# EAGLE design 1channelSimple (EAGLE 7.1.0)
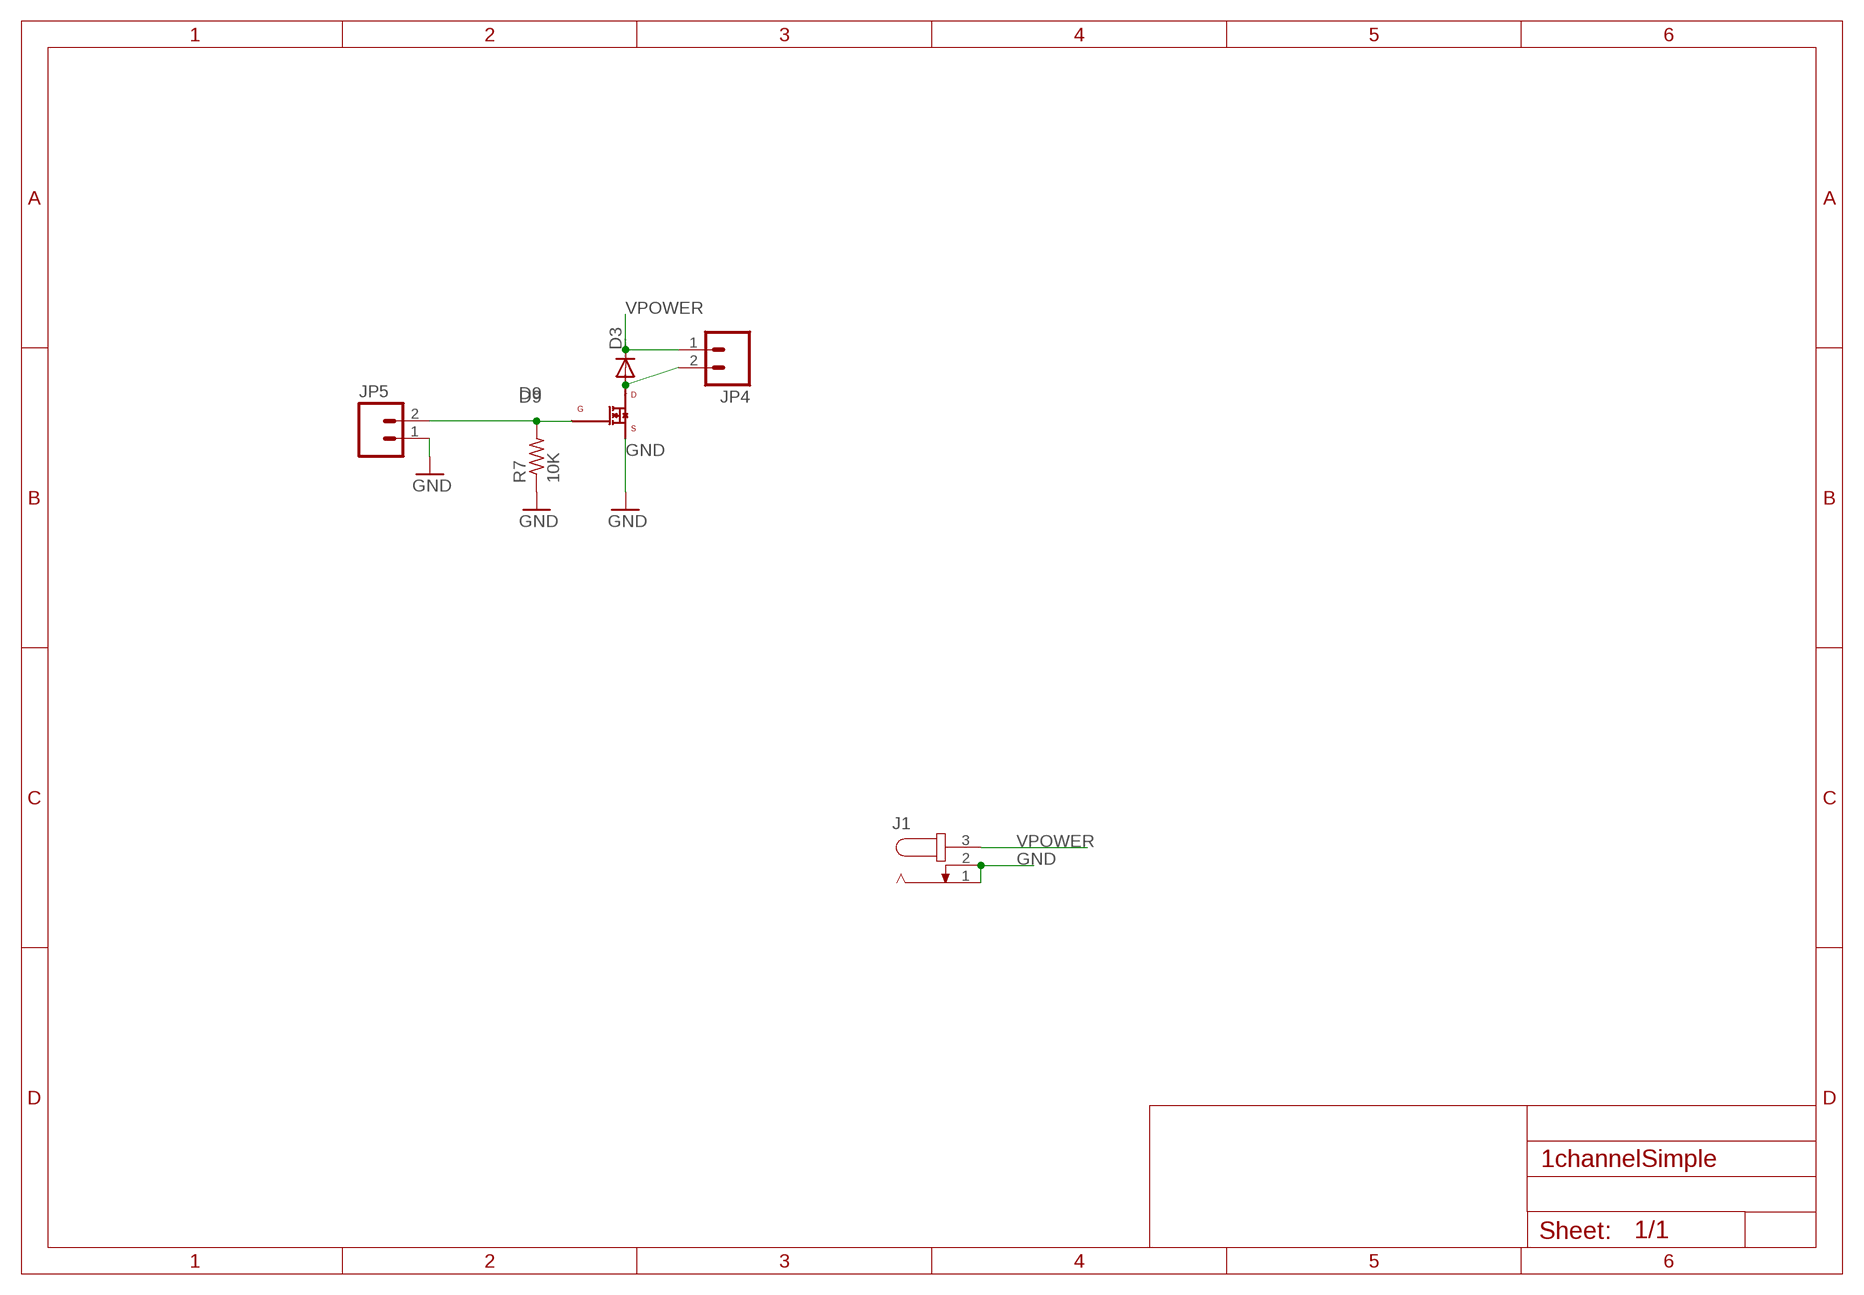
[diagram p0: schematic, sheet 1]

## Parts
D3  DIODE-DO-214AC  [DO-214AC]
J1  JACK-PLUG1  [SPC4078]
JP4  M02PTH  [1X02]
JP5  M02PTH  [1X02]
Q3  IRLML0060  [SOT-23]
R7  10K  R-US_R0603  [R0603]

## Nets
D9: JP5.2 Q3.1(GATE) R7.2
GND: J1.1 J1.2 JP5.1 Q3.2(SOURCE) R7.1
N$2: D3.A JP4.2 Q3.3(DRAIN)
VPOWER: D3.C J1.3 JP4.1

## Library data of the parts
D3 = diode:DIODE-: DIODE
J1 = con-jack:JACK-PLUG: DC POWER JACK Power Jack, DC, Right Angle, Through Hole, Rated 5A at 16VDC, PC Terminals Distributor: Farnell (www.Farnell.de) Drawing: 84N1161.pdf / 84N1162.pdf Manufacturer: SPC Technology (www.spctechnology.com) Type: SPC4077 / SPC 4078; OC_FARNELL: unknown; OC_NEWARK: unknown
JP4 JP5 = SparkFun-Connectors:M02: Standard 2-pin 0.1" header. Use with - straight break away headers ( PRT-00116) - right angle break away headers (PRT-00553) - swiss pins (PRT-00743) - machine pins (PRT-00117) - female headers (PRT-00115) Molex polarized connector foot print use with: PRT-08233 with associated crimp pins and housings. 2.54_SCREWTERM for use with PRT-10571. 3.5mm Screw Terminal footprints for PRT-08084 5mm Screw Terminal footprints for use with PRT-08432
Q3 = spietz-library:IRLML0060
R7 = resistor:R-US_: RESISTOR, American symbol

## Net classes
0 default: width 0.203 mm
1 vcc: width 0.254 mm

## Board
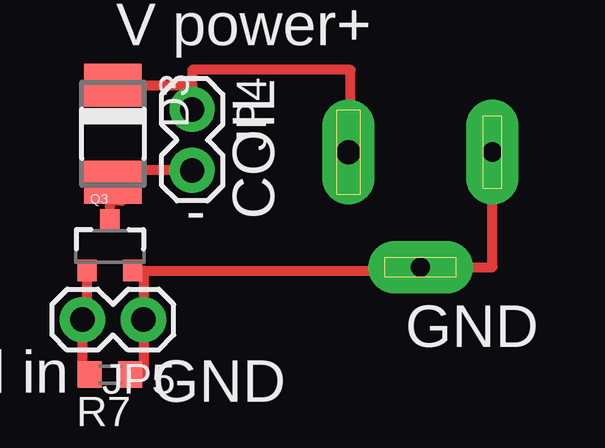
[diagram p1: board, top side]
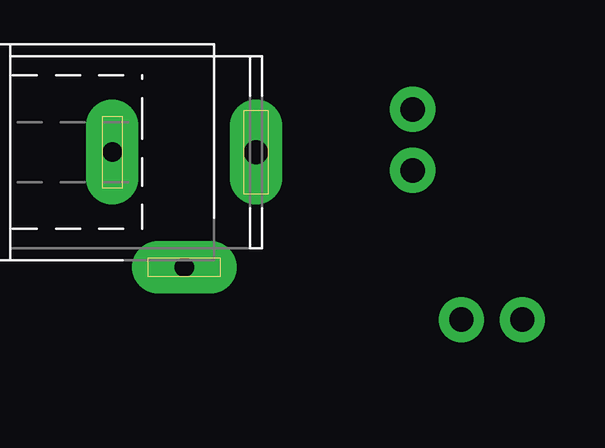
[diagram p2: board, bottom side, seen from below]

No outline drawn. Coordinates in mm, seen from the top.
Copper layers (1*16): Top 0.035mm / dielectric 1.5mm / Bottom 0.035mm
Design rules "default": minimum track width 10mil, minimum drill 24mil, track to track 8mil, track to pad 8mil, pad to pad 8mil, via to via 8mil, smd to smd 8mil, copper to edge 40mil, drill to drill 8mil, minimum pad ring 10mil, minimum via ring 8mil, stop-mask expansion 4mil, vias tented up to drill 0mil, thermal gap 10mil

### Footprints (pad centres in the part's own frame; a part is rotated, then mirrored left to right if it is on the bottom)
DO-214AC = smd 1.8 x 2.4: A 2.025,0; C -2.025,0
SPC4078 = drill 0.8 pad 2.184 long: 1 -3,0; 2 0,-4.8 | drill 1 pad 2.184 long: 3 3,0
1X02 = drill 1.016 pad 1.88: 1 0,0; 2 2.54,0
SOT-23 = smd 0.8 x 0.9: 1 -0.95,-1; 2 0.95,-1; 3 0,1.1
R0603 = smd 1 x 1.1: 1 -0.85,0; 2 0.85,0

### Placement (x,y rotation side)
D3  24.13,24.26 270 top
J1  36.96,23.5 0 bottom
JP4  27.43,25.27 270 top
JP5  25.4,16.51 180 top
Q3  24,19.56 0 top
R7  24,14.22 180 top

### Tracks (layer width: path | path; a pad name or v marks a point on that pad's centre or on a via)
D9
  Top 0.406: R7.2 22.86,14.22 JP5.2 23.05,16.51 Q3.1
GND
  Top 0.406: Q3.2 25.4,18.56 | 25.4,18.56 JP5.1 25.4,14.22 R7.1 | 25.4,18.56 36.96,18.56 J1.2 39.96,18.7 J1.1
N$2
  Top 0.406: JP4.2 24.51,22.73 24.51,21.46 24.13,21.46 | 24.13,21.46 D3.A | 24.13,21.46 24,21.46 Q3.3
VPOWER
  Top 0.406: J1.3 34.04,23.5 34.04,26.92 27.43,26.92 27.43,26.67 27.43,26.28 | 27.43,26.28 JP4.1 | D3.C 27.43,26.28

### Text on the board
tPlace: V power+ | COIL | - | GND | digital in | GND